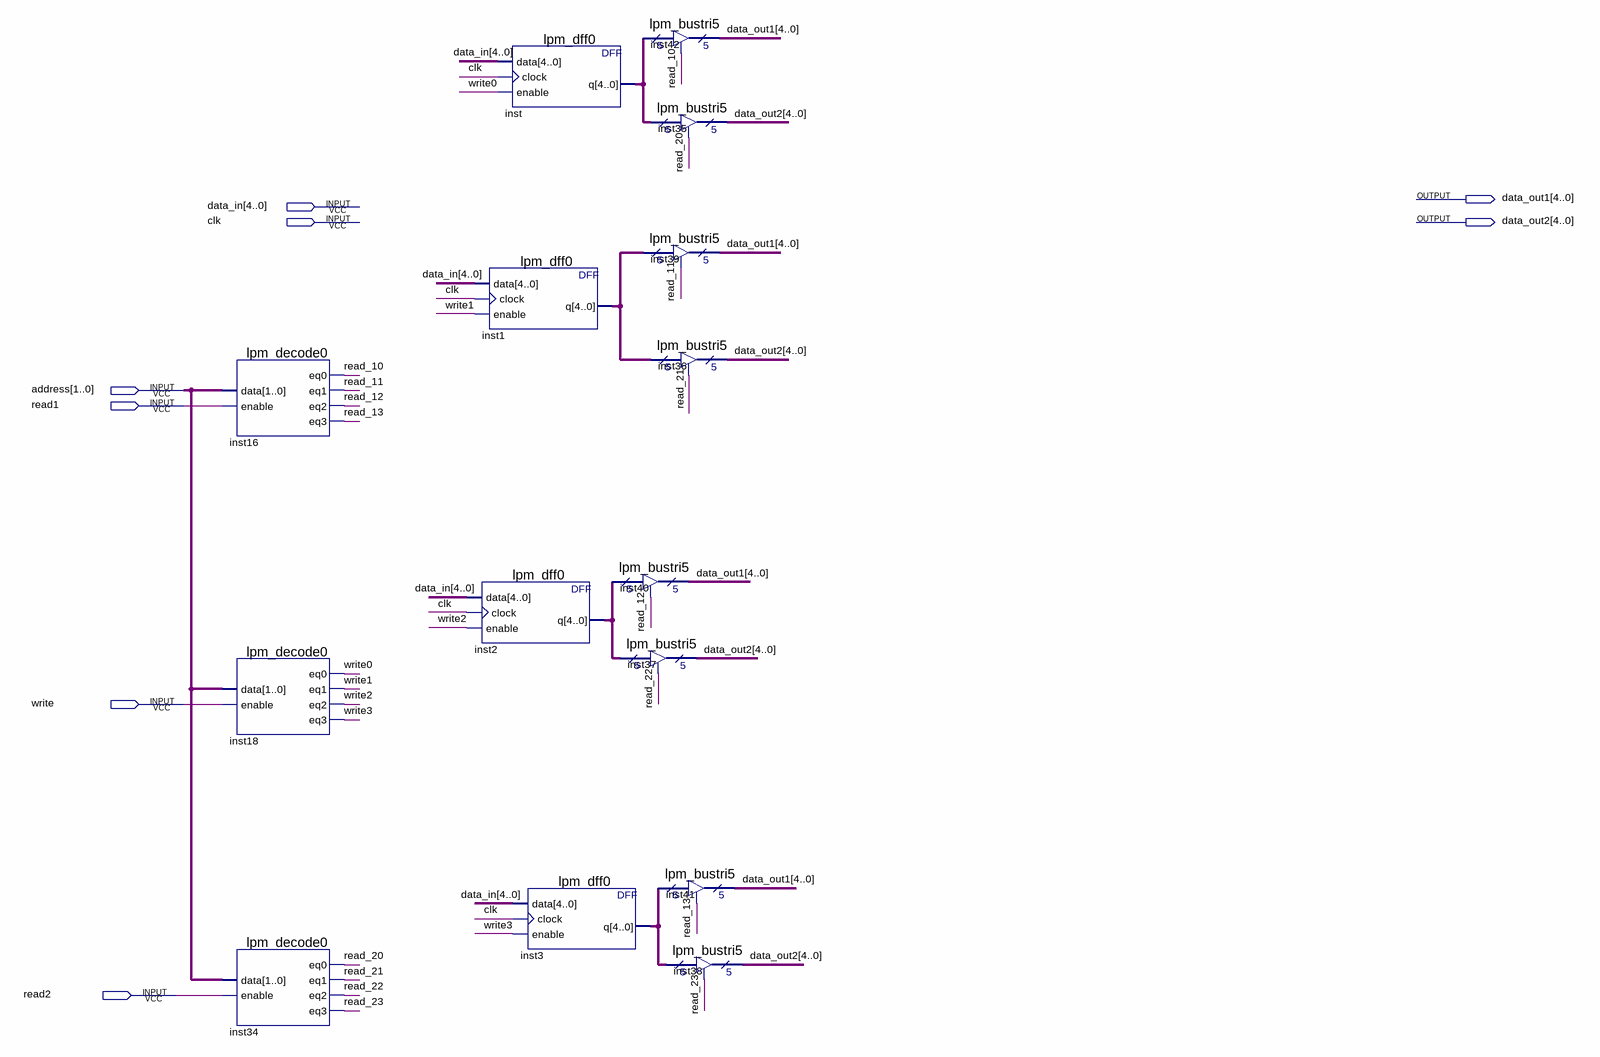
[diagram p0: schematic sheet]
// Quartus schematic cache_line.bdf as structural Verilog: 15 symbols, 8 pins
module cache_line (
  input  [4:0] data_in,
  input  clk,
  input  [1:0] address,
  input  read1,
  input  write,
  input  read2,
  output [4:0] data_out1,
  output [4:0] data_out2
);

  wire read_10, read_11, read_12, read_13, read_20, read_21, read_22, read_23, write0, write1, write2, write3;
  wire [4:0] inst1_q, inst2_q, inst3_q, inst_q;

  lpm_decode0 inst16 (.data(address), .enable(read1), .eq0(read_10), .eq1(read_11), .eq2(read_12), .eq3(read_13));
  lpm_decode0 inst18 (.data(address), .enable(write), .eq0(write0), .eq1(write1), .eq2(write2), .eq3(write3));
  lpm_decode0 inst34 (.data(address), .enable(read2), .eq0(read_20), .eq1(read_21), .eq2(read_22), .eq3(read_23));
  lpm_dff0 inst2 (.data(data_in), .clock(clk), .enable(write2), .q(inst2_q));
  lpm_dff0 inst (.data(data_in), .clock(clk), .enable(write0), .q(inst_q));
  lpm_dff0 inst1 (.data(data_in), .clock(clk), .enable(write1), .q(inst1_q));
  lpm_dff0 inst3 (.data(data_in), .clock(clk), .enable(write3), .q(inst3_q));
  lpm_bustri5 inst42 (.enabledt(read_10), .data(inst_q), .tridata(data_out1));
  lpm_bustri5 inst35 (.enabledt(read_20), .data(inst_q), .tridata(data_out2));
  lpm_bustri5 inst39 (.enabledt(read_11), .data(inst1_q), .tridata(data_out1));
  lpm_bustri5 inst36 (.enabledt(read_21), .data(inst1_q), .tridata(data_out2));
  lpm_bustri5 inst40 (.enabledt(read_12), .data(inst2_q), .tridata(data_out1));
  lpm_bustri5 inst37 (.enabledt(read_22), .data(inst2_q), .tridata(data_out2));
  lpm_bustri5 inst41 (.enabledt(read_13), .data(inst3_q), .tridata(data_out1));
  lpm_bustri5 inst38 (.enabledt(read_23), .data(inst3_q), .tridata(data_out2));
endmodule
